# EasyEDA Pro project bsides-newcastle-2024.epro

# Board board_first_version
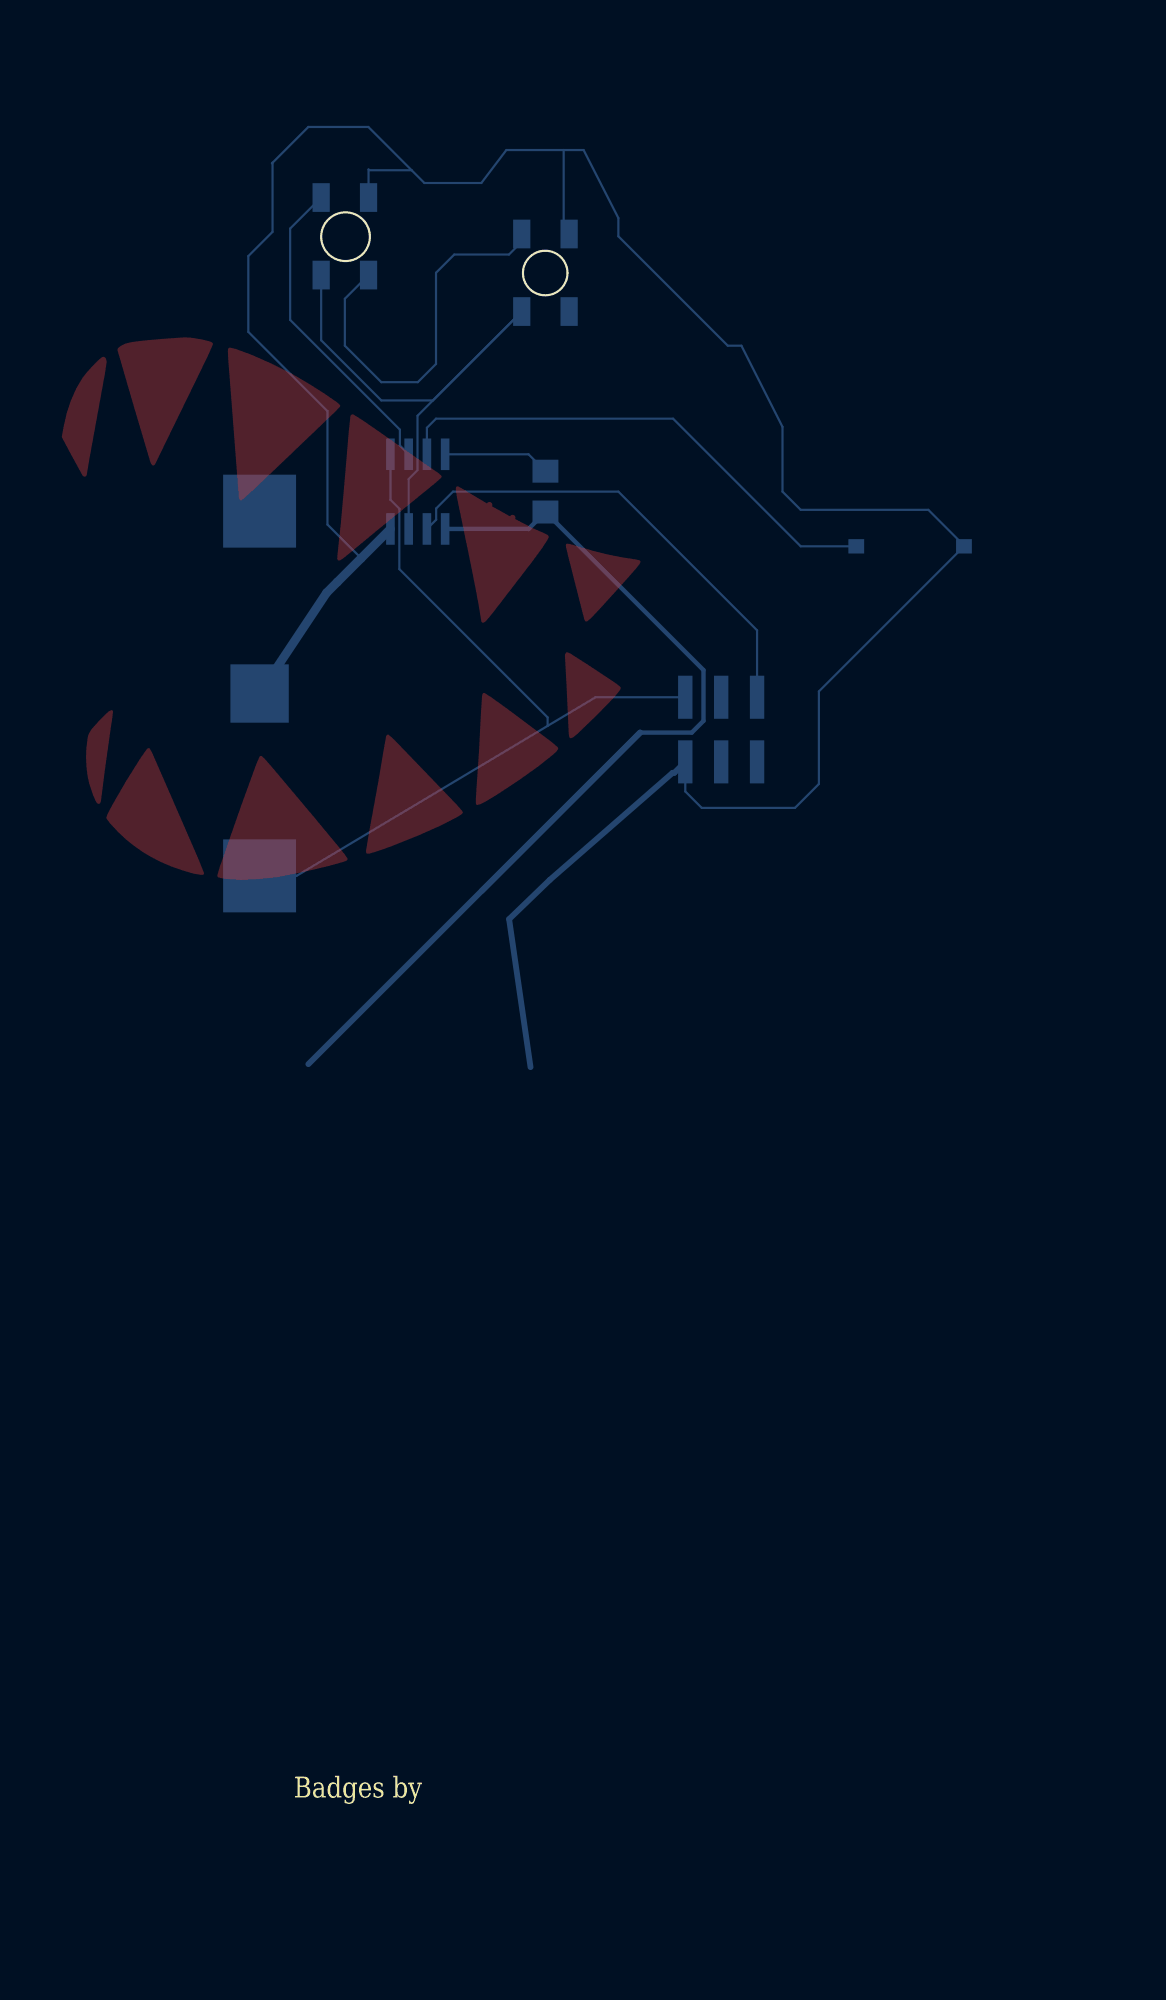
[diagram p0: board, top side]
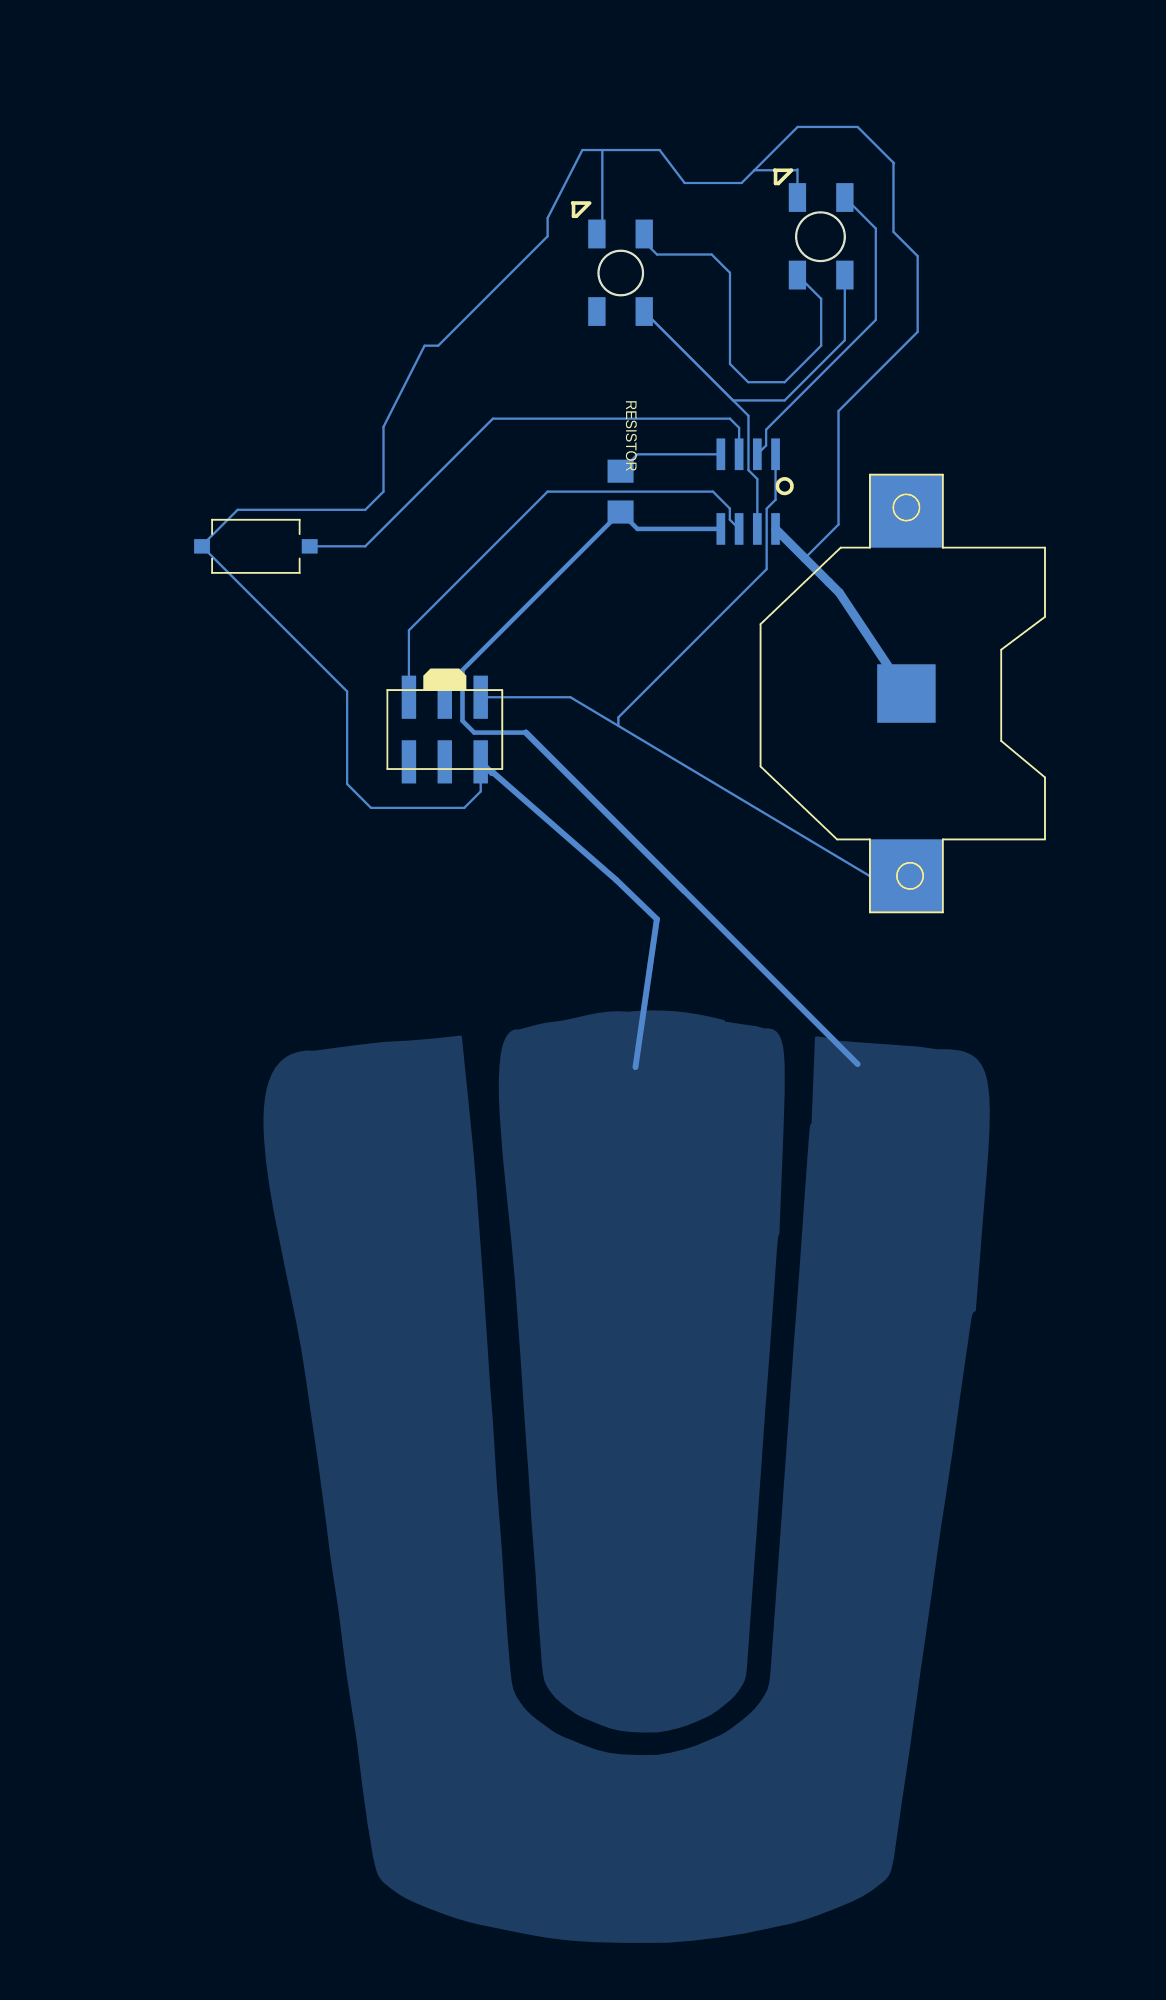
[diagram p1: board, bottom side, seen from below]

Outline 77.21 x 135.28 mm; copper layers: Top Layer, Bottom Layer. Coordinates in mm from the lower left corner of the outline.
Outline path: circle c22.06,120.8 r1.7 ; circle c35.97,118.27 r1.55 ; 0,108.21 0.06,107.21 0.2,106.18 0.42,105.13 0.71,104.07 1.09,102.99 1.36,102.18 1.67,101.05 2.23,99.37 2.55,98.56 2.9,97.75 3.71,96.1 4.7,94.34 5.19,93.48 5.34,93.16 5.44,92.89 5.5,92.62 5.53,92.34 5.5,91.6 5.47,90.9 5.11,90.49 4.54,89.75 4.02,88.92 3.57,88.06 3.24,87.2 3.06,86.55 2.91,85.86 2.81,85.21 2.77,84.68 2.73,84.16 2.59,83.64 2.19,82.27 2.07,81.77 2,81.35 1.98,80.86 1.97,80.11 2,79.07 2.09,78.15 2.26,77.31 2.5,76.48 2.85,75.59 3.25,74.83 3.74,74.12 4.36,73.42 4.76,73.04 5.18,72.68 5.64,72.34 6.12,72.03 6.63,71.75 7.17,71.5 7.74,71.27 8.34,71.06 8.96,70.89 9.6,70.74 10.28,70.61 10.98,70.52 12.45,70.4 14.02,70.4 15.08,70.45 16.09,70.53 17.15,70.66 18.34,70.85 19.13,70.97 19.37,70.99 19.54,70.97 19.64,70.92 19.69,70.83 19.68,70.52 19.57,69.95 19.5,69.7 16.62,69.32 14.53,69.05 13.53,68.95 13.3,68.93 13.04,68.86 11.77,68.55 10.35,68.19 8.06,67.48 7.02,67.1 5.99,66.67 5.07,66.22 4.34,65.78 3.92,65.46 3.53,65.08 3.2,64.67 2.95,64.27 2.84,64.04 2.79,63.83 2.77,63.56 2.79,63.13 2.94,61.38 3.13,59.48 3.21,58.46 3.37,57.15 4.07,52.03 4.54,48.68 4.69,47.66 4.83,46.92 4.9,46.75 5.03,46.55 5.42,46.12 5.94,45.69 6.53,45.31 7.79,44.7 8.4,44.44 8.79,44.3 8.95,44.23 9.06,44.06 9.15,43.68 9.26,43 10,38.38 10.42,35.56 10.64,34.2 11.17,31.01 11.31,30.2 11.52,29 12.47,22.82 12.82,20.69 13.11,18.89 13.32,17.5 13.49,16.4 13.93,13.5 14.51,9.98 14.94,7.26 15.15,5.91 15.25,5.45 15.35,5.1 15.47,4.83 15.62,4.62 15.79,4.44 16.02,4.26 16.8,3.7 17.57,3.27 18.5,2.85 19.78,2.38 21.08,1.92 22.13,1.6 23.08,1.36 24.11,1.16 25,0.99 26.72,0.66 28.62,0.39 30.66,0.17 32.76,0.01 35.93,0 38.24,0.05 40.21,0.16 42,0.35 43.76,0.63 47.29,1.28 48.12,1.46 49.08,1.72 50.18,2.06 51.42,2.49 52.28,2.81 52.94,3.09 53.49,3.38 54.04,3.72 54.69,4.19 54.92,4.4 55.09,4.62 55.23,4.88 55.34,5.19 55.57,6.06 55.99,8.38 56.39,10.97 56.82,14.11 56.99,15.17 57.17,16.19 57.59,18.66 57.73,19.65 58.09,22.33 58.23,23.25 58.44,24.52 58.66,25.79 58.9,27.27 59.15,29.1 59.34,30.49 59.64,32.45 59.77,33.33 59.99,34.68 60.41,37.29 60.88,40.18 61.15,41.94 61.37,43.6 61.42,43.93 61.51,44.16 61.64,44.3 61.83,44.38 62.33,44.56 63.22,44.95 64.13,45.39 64.92,45.83 65.5,46.23 65.69,46.4 65.81,46.55 65.94,46.96 66.06,47.72 66.34,49.6 66.79,52.77 67.01,54.53 67.19,56.27 67.37,57.89 67.55,59.3 67.66,59.42 67.95,62.59 67.98,63.23 67.96,63.82 67.91,63.95 67.84,64.03 67.72,64.19 67.64,64.42 67.52,64.71 67.25,65.03 66.87,65.39 66.37,65.76 65.78,66.13 65.11,66.51 64.37,66.87 63.59,67.21 62.7,67.54 61.68,67.89 60.72,68.18 60.05,68.36 59.54,68.49 59.05,68.65 58.65,68.77 58.34,68.82 57.9,68.89 57.03,69.07 55.86,69.29 54.32,69.55 52.83,69.71 51.77,69.83 50.23,70.04 48.82,70.26 48.17,70.4 48.14,70.49 48.23,70.61 48.44,70.76 48.77,70.94 49.3,71.17 49.88,71.38 50.42,71.52 50.81,71.58 51.01,71.6 51.16,71.64 51.23,71.71 51.21,71.78 51.09,71.83 50.87,71.88 50.12,71.95 49.06,72 47.75,72.02 45.96,71.99 44.39,71.88 42.97,71.68 41.64,71.4 40.93,71.22 38.62,71.4 36.81,71.52 35.69,71.58 35.07,71.58 35.11,71.77 35.53,72.92 35.92,73.87 36.23,73.99 37,74.19 37.48,74.29 38.04,74.46 39.36,74.96 40.85,75.63 42.41,76.44 42.71,76.63 42.89,76.79 43.01,76.9 43.13,76.94 43.33,77.03 43.62,77.26 43.91,77.48 44.09,77.57 44.4,77.74 44.96,78.14 45.54,78.54 45.87,78.7 45.94,78.68 46.03,78.62 46.26,78.33 46.61,77.78 47.11,76.92 47.52,76.27 47.64,76.13 47.73,76.09 47.95,76.2 48.27,76.48 48.7,76.87 49.94,76.59 50.84,76.4 51.79,76.23 54.1,75.92 56.21,75.65 58.03,75.36 59.6,75.03 60.96,74.66 62.17,74.22 63.25,73.7 64.27,73.1 65.25,72.39 65.79,71.93 66.39,71.35 66.95,70.75 67.39,70.22 67.61,69.96 67.81,69.81 68,69.75 68.21,69.77 68.32,69.81 68.4,69.87 68.46,69.97 68.5,70.14 68.51,70.69 68.47,71.67 68.4,72.75 68.3,73.66 68.16,74.56 67.96,75.62 67.71,76.7 67.41,77.76 67.06,78.79 66.66,79.8 66.21,80.78 65.71,81.72 65.17,82.63 64.59,83.51 63.96,84.35 63.3,85.15 62.59,85.92 61.85,86.63 61.07,87.31 60.25,87.93 59.4,88.51 58.52,89.04 58.15,89.28 58.05,89.37 58.02,89.44 58.05,89.51 58.14,89.6 58.53,89.82 59.46,90.32 60.44,90.91 61.58,91.66 62.99,92.64 65.02,94.07 66.41,95 67.47,95.64 68.53,96.19 69.55,96.66 70.56,97.04 71.57,97.34 72.58,97.56 73.58,97.69 74.58,97.74 75.58,97.7 76.59,97.58 76.99,97.53 77.21,97.53 77.21,98.85 76.41,99.61 75.74,100.25 75.04,100.85 74.34,101.42 73.62,101.96 72.9,102.46 72.16,102.93 71.4,103.37 70.64,103.77 69.87,104.14 69.08,104.48 68.28,104.79 67.48,105.06 66.66,105.3 65.84,105.5 65,105.67 64.15,105.81 63.09,105.88 61.68,105.9 60.27,105.86 59.22,105.77 58.33,105.61 57.43,105.41 56.54,105.17 55.7,104.91 54.92,104.66 54.75,104.64 54.67,104.68 54.57,104.92 54.46,105.37 54.29,106.13 54.05,107.01 53.49,108.82 52.97,110.21 52.38,111.55 51.73,112.83 51.02,114.06 50.23,115.25 49.38,116.39 48.46,117.48 47.47,118.54 46.52,119.46 45.63,120.24 44.74,120.93 43.76,121.6 42.87,122.19 42.43,122.51 42.33,122.61 42.28,122.7 42.22,122.92 41.97,123.8 41.61,124.75 41.18,125.65 40.74,126.36 40.38,126.83 39.99,127.26 39.58,127.65 39.15,128 38.7,128.31 38.23,128.59 37.75,128.82 37.25,129.01 36.84,129.12 36.4,129.14 36.23,129.68 36.03,130.19 35.79,130.68 35.53,131.15 35.25,131.6 34.94,132.02 34.6,132.42 34.24,132.8 33.47,133.48 32.64,134.07 31.77,134.56 30.86,134.95 30.22,135.14 29.58,135.25 28.97,135.28 28.15,135.23 27.33,135.08 26.52,134.85 25.71,134.55 25.15,134.3 24.6,134.02 24.07,133.69 23.56,133.32 23.09,132.91 22.68,132.44 22.31,131.91 22.02,131.33 21.76,131.31 21.12,131.25 20.53,131.13 19.94,130.94 19.32,130.67 18.88,130.44 18.46,130.18 18.04,129.88 17.64,129.55 17.25,129.18 16.88,128.78 16.52,128.35 16.18,127.9 15.53,126.89 14.96,125.78 14.47,124.58 14.05,123.28 13.79,122.16 13.64,121.34 12.88,120.75 11.39,119.53 10.95,119.16 10.68,118.97 10.44,118.87 10.12,118.81 10.05,118.74 8.22,118.4 7.34,118.12 6.5,117.81 5.71,117.45 4.97,117.06 4.27,116.62 3.62,116.14 3.02,115.63 2.47,115.08 1.97,114.49 1.53,113.86 1.14,113.2 0.8,112.5 0.52,111.77 0.29,111.01 0.12,110.12 0.02,109.19 0,108.21 ; 25.19,130.01 25.43,130.33 25.82,130.7 26.35,131.07 27,131.39 27.58,131.58 28.16,131.71 28.71,131.77 29.17,131.8 29.49,131.79 29.68,131.75 30.25,131.51 30.79,131.21 31.3,130.85 31.78,130.43 32.2,129.97 32.57,129.46 32.87,128.9 33.09,128.3 32.45,127.88 31.82,127.38 31.23,126.81 30.71,126.22 30.4,125.89 30.17,125.86 29.68,125.85 28.41,125.88 27.84,125.91 27.64,126.42 27.26,127.31 26.83,128.09 26.35,128.79 25.79,129.44 25.19,130.01
Stack: Top Layer 0.035mm / Dielectric1 1.51mm FR4 er 4.5 / Bottom Layer 0.035mm

## Design rules (mm)
spacing safeClearance (default): track to track 0.152, other pairs 0 to 0.152
track width trackWidth (default): min 0.003, default 0.003, max 2.54
differential pair differentialPair (default): width min 0.127, default 0.254, max 2.54; gap min 0.152, default 0.152
via viaSize (default): diameter min 0, default 0, max 2.6; hole min 0, default 0, max 2
net SENSE uses CopperRegion1
net N$20 uses CopperRegion2
net N$21 uses CopperRegion3
net N$22 uses CopperRegion4
net N$23 uses CopperRegion5
net N$24 uses CopperRegion6
net N$25 uses CopperRegion7
net N$26 uses CopperRegion8
net N$27 uses CopperRegion9
net N$28 uses CopperRegion10
net N$29 uses CopperRegion11
net N$30 uses CopperRegion12
net N$4 uses CopperRegion13
pour ie58 uses CopperRegion
pour ie104 uses CopperRegion1
pour ie105 uses CopperRegion2
pour ie106 uses CopperRegion3
pour ie107 uses CopperRegion4
pour ie108 uses CopperRegion5
pour ie109 uses CopperRegion6
pour ie110 uses CopperRegion7
pour ie111 uses CopperRegion8
pour ie112 uses CopperRegion9
pour ie113 uses CopperRegion10
pour ie114 uses CopperRegion11
pour ie115 uses CopperRegion12
pour ie116 uses CopperRegion13

## Placement (name value [footprint] x y rotation side)
D1  SK6812_5050_REVERSEMOUNTREVERSE_NO_CUT  [SK6812_REVERSE_NO_CUT]  22.02 120.82 270 bottom
D2  SK6812_5050_REVERSEMOUNTREVERSE_NO_CUT  [SK6812_REVERSE_NO_CUT]  35.99 118.28 270 bottom
RESISTOR  -  [R1206]  35.99 103.04 270 bottom
S1  SWITCH  [SW_TS09-63-25-X-260-SMT-TR]  61.39 99.23 0 bottom
U$1  -  [CR2032-SMD]  16.08 88.98 270 bottom
U$2  ATTINYX02  [SOIC08_JEDEC_150MIL]  27.1 103.04 0 bottom
U$3  SAO  [SAO_SMD]  51.23 82.72 180 bottom

## Footprints (pads in the part's own frame, mm; a bottom-side part is the same pattern mirrored in y, then rotated)
CR2032-SMD
  rect 5.08x5.08 smd: +$1(-12.7,0) +$2(12.7,0)
  rect 4.064x4.064 smd: -(0,0)
R1206
  rect 1.6x1.803 smd: 1(-1.422,0) 2(1.422,0)
SAO_SMD
  rect 1x3 smd: GND(5.5,1.5) GPIO1(0.5,6) GPIO2(0.5,1.5) SCL(3,1.5) SDA(3,6) VCC(5.5,6)
SK6812_REVERSE_NO_CUT
  rect 2x1.2 smd: 1-GND(-2.7,-1.65) 2-DIN(-2.7,1.65) 3-VDD(2.7,1.65) 4-DOUT(2.7,-1.65)
SOIC08_JEDEC_150MIL
  rect 0.6x2.2 smd: 1(-1.905,-2.6) 2(-0.635,-2.6) 3(0.635,-2.6) 4(1.905,-2.6) 5(1.905,2.6) 6(0.635,2.6) 7(-0.635,2.6) 8(-1.905,2.6)
SW_TS09-63-25-X-260-SMT-TR
  rect 1.1x1 smd: 1(-3.75,0) 2(3.75,0)

## Nets
N$1: U$1.+$1 U$1.+$2 U$2.1 U$3.VCC
N$2: D1.1-GND D2.1-GND S1.2 U$1.- U$2.8 U$3.GND
N$3: RESISTOR.1 U$2.4
N$5: S1.1 U$2.3
N$6: D1.2-DIN U$2.2
N$7: D1.4-DOUT D2.2-DIN
N$8: D1.3-VDD D2.3-VDD U$2.7
N$9: U$2.6 U$3.GPIO1
SENSE: RESISTOR.2 U$2.5

Pads without a net: D2 4-DOUT; U$3 GPIO2 SCL SDA

## Routing (per net, layer and track width the routed paths; a pad name or vN(x,y) marks a point on that pad's centre or on a via; arc(x,y) is an arc through that point)
N$1: length 56.5
  Bottom Layer w0.152: 36.14,86.73 39.48,88.72 U$3.VCC ; 36.14,86.73 36.14,87.32 25.81,97.65 25.81,101.86 25.19,102.48 U$2.1 ; 36.14,86.73 18.65,76.28 U$1.+$2
N$2: length 186.6
  Bottom Layer w0.152: U$3.GND 45.73,82.17 46.88,81.02 53.37,81.02 55.03,82.68 55.03,89.13 S1.2 65.14,99.29 62.66,101.77 53.77,101.77 52.5,103.04 52.5,107.56 49.64,113.2 48.69,113.2 41.07,120.82 41.07,122.09 38.65,126.83 37.26,126.83 ; D2.1-GND 37.26,121.36 37.26,126.83 ; 23.15,98.4 20.81,100.75 20.81,108.65 15.29,114.17 15.29,119.45 16.98,121.13 16.98,125.95 ; D1.1-GND 23.67,125.48 23.72,125.43 26.67,125.43 ; 26.67,125.43 23.65,128.44 19.47,128.44 16.98,125.95 ; 26.67,125.43 27.56,124.54 31.52,124.54 33.27,126.83 37.26,126.83 ; 16.94,125.9 16.98,125.95 ; 21.49,96.74 21.26,96.51
  Bottom Layer w0.406: U$3.GND 44.96,83.46 44.84,83.46 36.29,76 33.46,73.27 34.95,62.97
  Bottom Layer w0.61: U$2.8 20.75,96 U$1.-
N$3: length 7.5
  Bottom Layer w0.152: U$2.4 34.81,105.64 RESISTOR.1
N$5: length 35.7
  Bottom Layer w0.152: S1.1 53.77,99.23 44.88,108.12 28.37,108.12 27.73,107.49 U$2.3
N$6: length 22.2
  Bottom Layer w0.152: D1.2-DIN 18.21,121.36 18.21,115 25.85,107.36 25.85,106.26 U$2.2
N$7: length 27.3
  Bottom Layer w0.152: D2.2-DIN 34.34,120.44 33.45,119.55 29.64,119.55 28.37,118.28 28.37,111.93 27.1,110.66 24.56,110.66 22.02,113.2 22.02,116.47 D1.4-DOUT
N$8: length 41.2
  Bottom Layer w0.152: D1.3-VDD 20.37,113.58 24.56,109.39 28.15,109.39 34.34,115.58 D2.3-VDD 27.08,108.33 27.08,104.54 26.46,103.92 U$2.7
N$9: length 33.2
  Bottom Layer w0.152: U$2.6 28.38,101.09 28.38,101.87 29.55,103.04 41.07,103.04 50.73,93.38 U$3.GPIO1
SENSE: length 79.6
  Bottom Layer w0.305: 42.58,86.26 46.18,86.26 47,87.08 47,90.61 RESISTOR.2 34.81,100.44 U$2.5
  Bottom Layer w0.406: 31.55,75.23 42.58,86.26 19.48,63.18

## Copper pours and planes (outline as drawn; the poured copper is in the pictures)
N$2 on Bottom Layer: 24.63,58.7 24.55,61.23 24.56,63.1 24.6,63.81 24.67,64.39 24.78,64.85 24.93,65.19 25.12,65.43 25.36,65.59 25.64,65.66 25.98,65.66 26.43,65.79 26.6,65.83 27.7,65.98 28.71,66.13 28.74,66.24 29.68,66.46 30.57,66.64 31.41,66.77 32.23,66.86 33.04,66.91 33.84,66.92 34.65,66.89 35.48,66.82 36.17,66.86 36.86,66.83 37.53,66.74 38.19,66.61 39.42,66.33 39.98,66.22 40.5,66.14 41.16,66.07 41.79,65.93 43.05,65.59 43.29,65.59 43.51,65.53 43.7,65.4 43.87,65.22 44.01,64.98 44.13,64.69 44.24,64.34 44.32,63.95 44.43,63.04 44.47,61.98 44.46,60.79 44.4,59.49 44.18,56.67 43.88,53.7 43.58,50.77 43.34,48.07 43.18,45.81 43.03,43.77 42.96,42.72 42.91,42.03 42.73,39.4 42.56,36.81 42.48,35.82 42.41,34.82 42.23,32.01 42.18,31.23 42.03,29.3 41.97,28.5 41.91,27.67 41.76,25.21 41.47,21.38 41.39,20.69 41.3,20.25 41.16,19.91 40.93,19.54 40.54,19.05 40,18.58 39.17,17.97 38.83,17.77 38.54,17.63 37.29,17.13 36.67,16.9 36.04,16.75 35.34,16.67 34.53,16.63 33.4,16.64 32.66,16.76 31.94,16.93 31.27,17.15 30.66,17.4 30.35,17.54 29.98,17.7 29.64,17.88 29.27,18.13 28.81,18.49 28.36,18.86 28.03,19.19 27.76,19.53 27.48,19.96 27.34,20.24 27.25,20.62 27.18,21.26 27.1,22.31 26.95,24.44 26.59,29.47 26.53,30.32 26.45,31.42 26.35,32.82 26.23,34.49 25.89,39.32 25.82,40.26 25.77,40.9 25.58,43.4 25.51,44.46 25.35,46.67 25.09,50.28 25.02,51.11 24.98,51.25 24.93,51.3
N$4 on Top Layer: 4.01,85.13 3.99,84.52 4.02,83.87 4.1,83.24 4.22,82.69 4.5,81.87 4.64,81.55 4.74,81.37 4.83,81.29 4.92,81.29 4.99,81.37 5.03,81.51 5.29,83.54 5.71,86.54 5.84,87.4 5.88,87.79 5.83,87.83 5.77,87.84 5.59,87.75 5.3,87.5 4.89,87.07 4.44,86.57 4.3,86.38 4.2,86.2 4.13,86.01 4.09,85.79
N$20 on Top Layer: 2.43,107.55 2.3,106.84 2.99,105.54 3.75,104.16 3.84,104.09 3.93,104.08 4,104.13 4.05,104.23 4.27,105.55 4.94,109.25 5.28,111.12 5.43,112.05 5.4,112.25 5.33,112.38 5.23,112.44 5.1,112.41 4.84,112.19 4.44,111.79 4.03,111.33 3.74,110.96 3.31,110.23 2.94,109.39 2.64,108.49
N$21 on Top Layer: 6.19,112.98 6.19,112.89 7.26,109.19 8.43,105.25 8.51,105.01 8.6,104.88 8.69,104.85 8.79,104.93 9.62,106.65 11.61,110.72 12.48,112.49 12.84,113.31 12.79,113.42 12.61,113.51 12.25,113.6 11.65,113.71 11.24,113.77 10.83,113.78 9.18,113.67 7.96,113.56 7.21,113.47 6.76,113.36 6.45,113.22 6.23,113.05
N$22 on Top Layer: 13.89,112.24 13.87,112.84 13.89,113.06 14.06,113.07 14.41,112.98 15.51,112.57 16.92,111.95 18.36,111.23 19.43,110.61 20.53,109.91 21.38,109.33 21.63,109.13 21.73,109.02 21.37,108.64 20.51,107.8 17.08,104.53 15.49,103.03 14.78,102.39 14.73,102.39 14.69,102.42 14.63,102.66 14.5,104.46 14.1,109.6
N$23 on Top Layer: 21.52,98.81 21.49,98.37 21.52,98.26 21.59,98.23 21.71,98.27 21.89,98.38 22.44,98.83 24.35,100.42 27.32,102.82 28.35,103.67 28.78,104.06 28.74,104.15 28.57,104.3 27.58,105 24.62,107.07 23.25,108.02 22.59,108.43 22.46,108.42 22.4,108.29 22.29,107.19 22.01,103.86 21.74,100.93
N$24 on Top Layer: 29.76,103.38 29.75,103.16 29.82,102.68 29.98,101.88 30.86,97.64 31.29,95.4 31.53,93.97 31.57,93.93 31.67,93.91 31.76,93.95 31.89,94.08 32.3,94.58 34.08,96.88 35.09,98.2 35.77,99.12 36.13,99.68 36.21,99.84 36.22,99.93 36.14,100.03 36.02,100.09 35.13,100.49 33.7,101.23 32.09,102.12 30.66,102.97 30.11,103.3 29.84,103.44 29.79,103.42
N$25 on Top Layer: 37.43,99.41 37.41,99.33 37.42,99.17 37.55,98.62 38.69,94.17 38.75,94.02 38.81,93.99 38.87,93.99 39.19,94.26 39.77,94.87 41.57,96.86 42.33,97.72 42.54,97.99 42.61,98.13 42.6,98.21 42.55,98.26 42.28,98.32 41.25,98.48 40.28,98.68 39.33,98.91 38.35,99.21 37.69,99.39 37.51,99.42
N$26 on Top Layer: 37.46,89.56 37.35,91.61 37.35,91.71 37.41,91.82 37.44,91.85 37.5,91.86 37.71,91.78 38.98,90.97 40.83,89.74 41.1,89.54 41.23,89.4 41.23,89.33 41.18,89.22 40.89,88.85 40.3,88.22 39.35,87.26 38.23,86.18 37.93,85.94 37.78,85.87 37.72,85.87 37.67,85.9 37.63,86.02 37.6,86.26
N$27 on Top Layer: 31.18,82.25 31.14,81.59 31.15,81.28 31.19,81.23 31.26,81.22 31.5,81.29 31.93,81.53 32.63,81.95 34.12,82.93 35.48,83.9 36.48,84.69 36.77,84.96 36.88,85.13 36.88,85.18 36.83,85.26 36.42,85.61 33.21,88.01 32.19,88.74 31.71,89.04 31.62,89 31.57,88.81 31.5,87.63 31.36,84.98
N$28 on Top Layer: 23.5,77.9 23.49,78.01 23.73,79.48 24.3,82.56 24.72,85.06 24.89,86.01 24.95,86.13 25.04,86.14 25.42,85.8 26.18,85.02 28.72,82.37 29.81,81.24 30.14,80.87 30.26,80.7 30.14,80.57 29.81,80.36 28.63,79.77 27.03,79.05 25.28,78.35 24.31,78.01 23.75,77.84 23.61,77.83 23.53,77.84
N$29 on Top Layer: 13.3,76.9 13.14,76.33 13.14,76.24 13.17,76.19 13.35,76.13 13.72,76.08 14.78,76 16.05,76.06 17.39,76.21 19.08,76.55 20.81,76.95 22.02,77.29 22.19,77.38 22.22,77.47 22.03,77.74 21.52,78.39 19.84,80.42 16.87,83.95 16.41,84.46 16.25,84.61 16.16,84.67 16.11,84.63 16.04,84.51 15.81,83.96 14.82,81.23
N$30 on Top Layer: 5.49,80.59 5.39,80.31 5.65,79.95 6.23,79.34 6.76,78.84 7.32,78.38 7.91,77.97 8.54,77.59 9.2,77.25 9.9,76.95 10.64,76.69 11.42,76.46 11.98,76.35 12.15,76.36 12.24,76.41 11.89,77.31 10.99,79.36 9.1,83.72 8.58,84.89 8.44,85.13 8.35,85.22 8.28,85.17 8.16,85.02 7.79,84.5 6.77,82.87 5.8,81.18
SENSE on Bottom Layer: 10.31,60.96 10.27,59.87 10.3,58.58 10.38,57.09 10.5,55.37 10.84,51.21 11.25,45.98 11.39,45.91 11.48,45.73 11.57,45.36 11.67,44.69 12.33,40.1 12.71,37.29 12.9,35.95 13.38,32.77 13.51,31.97 13.69,30.78 14.55,24.64 14.86,22.53 15.12,20.74 15.31,19.35 15.46,18.27 15.86,15.38 16.38,11.89 16.77,9.19 16.96,7.85 17.14,7.04 17.24,6.77 17.37,6.56 17.53,6.38 17.73,6.2 18.44,5.65 19.13,5.22 19.96,4.81 21.1,4.33 22.28,3.88 23.22,3.56 24.07,3.33 25,3.13 25.79,2.96 27.34,2.63 29.05,2.36 30.87,2.14 32.76,1.98 35.61,1.97 37.68,2.02 39.45,2.13 41.05,2.32 42.64,2.6 45.8,3.24 46.55,3.42 47.41,3.68 48.39,4.02 49.51,4.45 50.28,4.77 50.87,5.04 51.37,5.33 51.87,5.67 52.45,6.14 52.65,6.34 52.8,6.57 52.93,6.82 53.03,7.13 53.23,8 53.61,10.29 53.97,12.87 54.35,15.99 54.51,17.04 54.67,18.06 55.05,20.51 55.18,21.49 55.62,25.06 55.81,26.33 56.01,27.59 56.22,29.06 56.45,30.88 56.89,34.21 57.01,35.09 57.2,36.42 57.58,39.01 58,41.88 58.27,43.54 58.6,45.31 59.37,49.02 60.12,52.79 60.44,54.62 60.68,56.38 60.83,58.02 60.86,58.8 60.85,59.54 60.82,60.23 60.74,60.89 60.62,61.49 60.46,62.04 60.26,62.53 60,62.97 59.69,63.34 59.32,63.64 58.9,63.88 58.42,64.04 57.87,64.12 57.25,64.11 54.06,64.54 52.44,64.72 50.78,64.81 49.01,64.96 47.05,65.17 46.51,59.88 46.26,57.33 46.06,54.97 45.85,52.1 45.66,49.5 45.56,48.17 45.51,47.29 45.28,43.97 45.06,40.67 44.97,39.41 44.87,38.15 44.65,34.57 44.58,33.59 44.4,31.14 44.32,30.12 44.24,29.07 44.04,25.95 43.87,23.38 43.68,21.08 43.58,20.22 43.46,19.65 43.28,19.22 42.99,18.76 42.75,18.41 42.5,18.13 42.2,17.85 41.81,17.53 40.76,16.76 40.33,16.51 39.96,16.33 38.38,15.69 37.59,15.41 36.79,15.22 35.9,15.11 34.86,15.06 33.44,15.07 32.5,15.22 31.58,15.44 30.73,15.72 29.96,16.04 29.56,16.21 29.1,16.41 28.67,16.65 28.2,16.97 27.61,17.42 27.04,17.89 26.62,18.3 26.28,18.74 25.93,19.29 25.75,19.65 25.63,20.12 25.54,20.93 25.44,22.27 25.25,24.97 24.79,31.35 24.71,32.44 24.62,33.83 24.49,35.61 24.34,37.73 23.91,43.86 23.81,45.05 23.75,45.86 23.51,49.03 23.42,50.38 23.22,53.18 22.9,57.77 22.8,58.82 22.75,58.99 22.68,59.06 22.45,65.12 20.92,64.94 20.85,64.81 18.27,64.61 15.5,64.42 15.06,64.37 13.92,64.21 13.06,64.2 12.34,64.11 12.02,64.03 11.74,63.92 11.48,63.78 11.25,63.61 11.05,63.41 10.88,63.17 10.73,62.9 10.6,62.59 10.5,62.25 10.42,61.86

## Text on the board
Top Silkscreen Layer: Badges by
